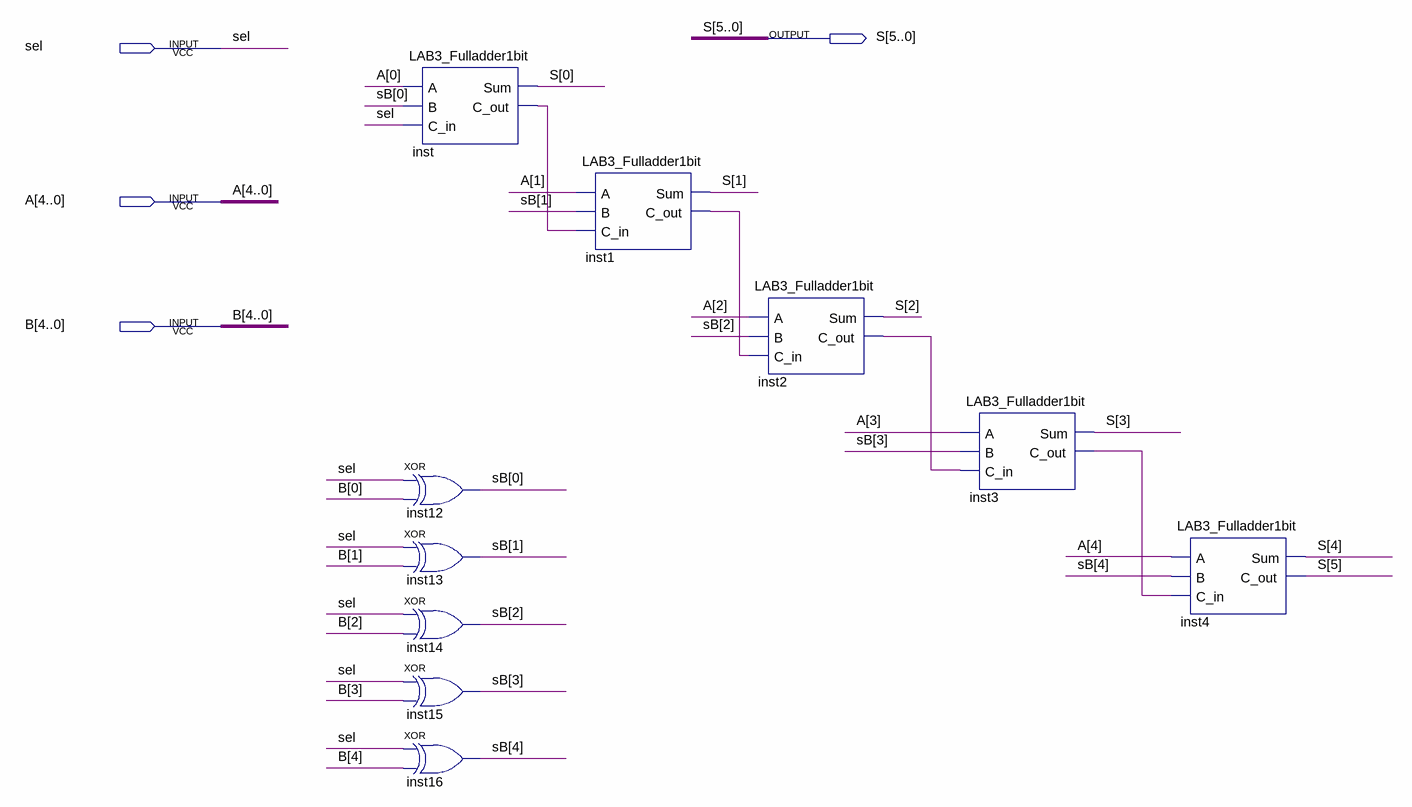
[diagram p0: schematic sheet]
// Quartus schematic add_sub5bit.bdf as structural Verilog: 10 symbols, 4 pins
module add_sub5bit (
  input  sel,
  input  [4:0] A,
  input  [4:0] B,
  output [5:0] S
);

  wire inst1_c_out, inst2_c_out, inst3_c_out, inst_c_out;
  wire [4:0] sB;

  LAB3_Fulladder1bit inst (.A(A[0]), .B(sB[0]), .C_in(sel), .Sum(S[0]), .C_out(inst_c_out));
  xor inst12 (sB[0], sel, B[0]);
  xor inst13 (sB[1], sel, B[1]);
  xor inst14 (sB[2], sel, B[2]);
  xor inst15 (sB[3], sel, B[3]);
  xor inst16 (sB[4], sel, B[4]);
  LAB3_Fulladder1bit inst1 (.A(A[1]), .B(sB[1]), .C_in(inst_c_out), .Sum(S[1]), .C_out(inst1_c_out));
  LAB3_Fulladder1bit inst2 (.A(A[2]), .B(sB[2]), .C_in(inst1_c_out), .Sum(S[2]), .C_out(inst2_c_out));
  LAB3_Fulladder1bit inst3 (.A(A[3]), .B(sB[3]), .C_in(inst2_c_out), .Sum(S[3]), .C_out(inst3_c_out));
  LAB3_Fulladder1bit inst4 (.A(A[4]), .B(sB[4]), .C_in(inst3_c_out), .Sum(S[4]), .C_out(S[5]));
endmodule
